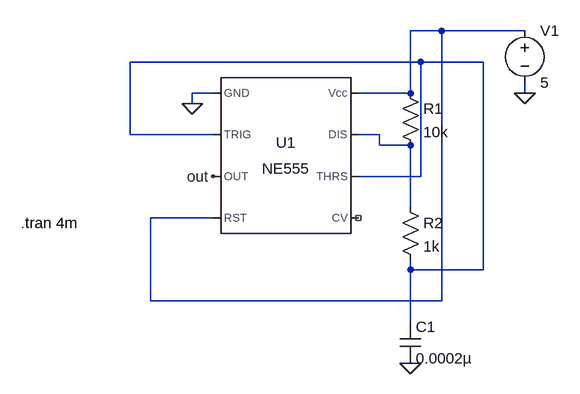
[diagram p0: schematic Ne_555_Buzzer.asc]
Ne_555_Buzzer.asc, the LTspice schematic file:
Version 4
SHEET 1 880 680
WIRE 672 96 624 96
WIRE 800 96 672 96
WIRE 640 144 192 144
WIRE 736 144 640 144
WIRE 320 192 288 192
WIRE 624 192 624 96
WIRE 624 192 544 192
WIRE 800 192 800 176
WIRE 288 208 288 192
WIRE 192 256 192 144
WIRE 320 256 192 256
WIRE 576 256 544 256
WIRE 576 272 576 256
WIRE 624 272 576 272
WIRE 640 320 640 144
WIRE 640 320 544 320
WIRE 624 368 624 272
WIRE 320 384 224 384
WIRE 624 464 624 448
WIRE 736 464 736 144
WIRE 736 464 624 464
WIRE 224 512 224 384
WIRE 672 512 672 96
WIRE 672 512 224 512
WIRE 624 544 624 464
FLAG 288 208 0
FLAG 800 192 0
FLAG 624 608 0
FLAG 320 320 out
SYMBOL Misc/NE555 432 288 R0
SYMATTR InstName U1
SYMBOL Voltage 800 80 R0
SYMATTR InstName V1
SYMATTR Value 5
SYMBOL Res 608 176 R0
SYMATTR InstName R1
SYMATTR Value 10k
SYMBOL Res 608 352 R0
SYMATTR InstName R2
SYMATTR Value 1k
SYMBOL Cap 608 544 R0
SYMATTR InstName C1
SYMATTR Value 0.0002µ
TEXT 24 392 Left 2 !.tran 4m

The netlist it stands for:
* Ne_555_Buzzer.asc
XU1 0 N002 out N001 NC_01 N002 N003 N001 NE555  ; pins GND TRIG OUT RST CV THRS DIS Vcc
V1 N001 0 5
R1 N001 N003 10k
R2 N003 N002 1k
C1 N002 0 0.0002µ
.tran 4m
.lib NE555.sub
.backanno
.end